# EAGLE schematic PCB(beta) (EAGLE 8.1.0), part 2 of 2
## Sheet 19 of 20: USB 3.0 Hub
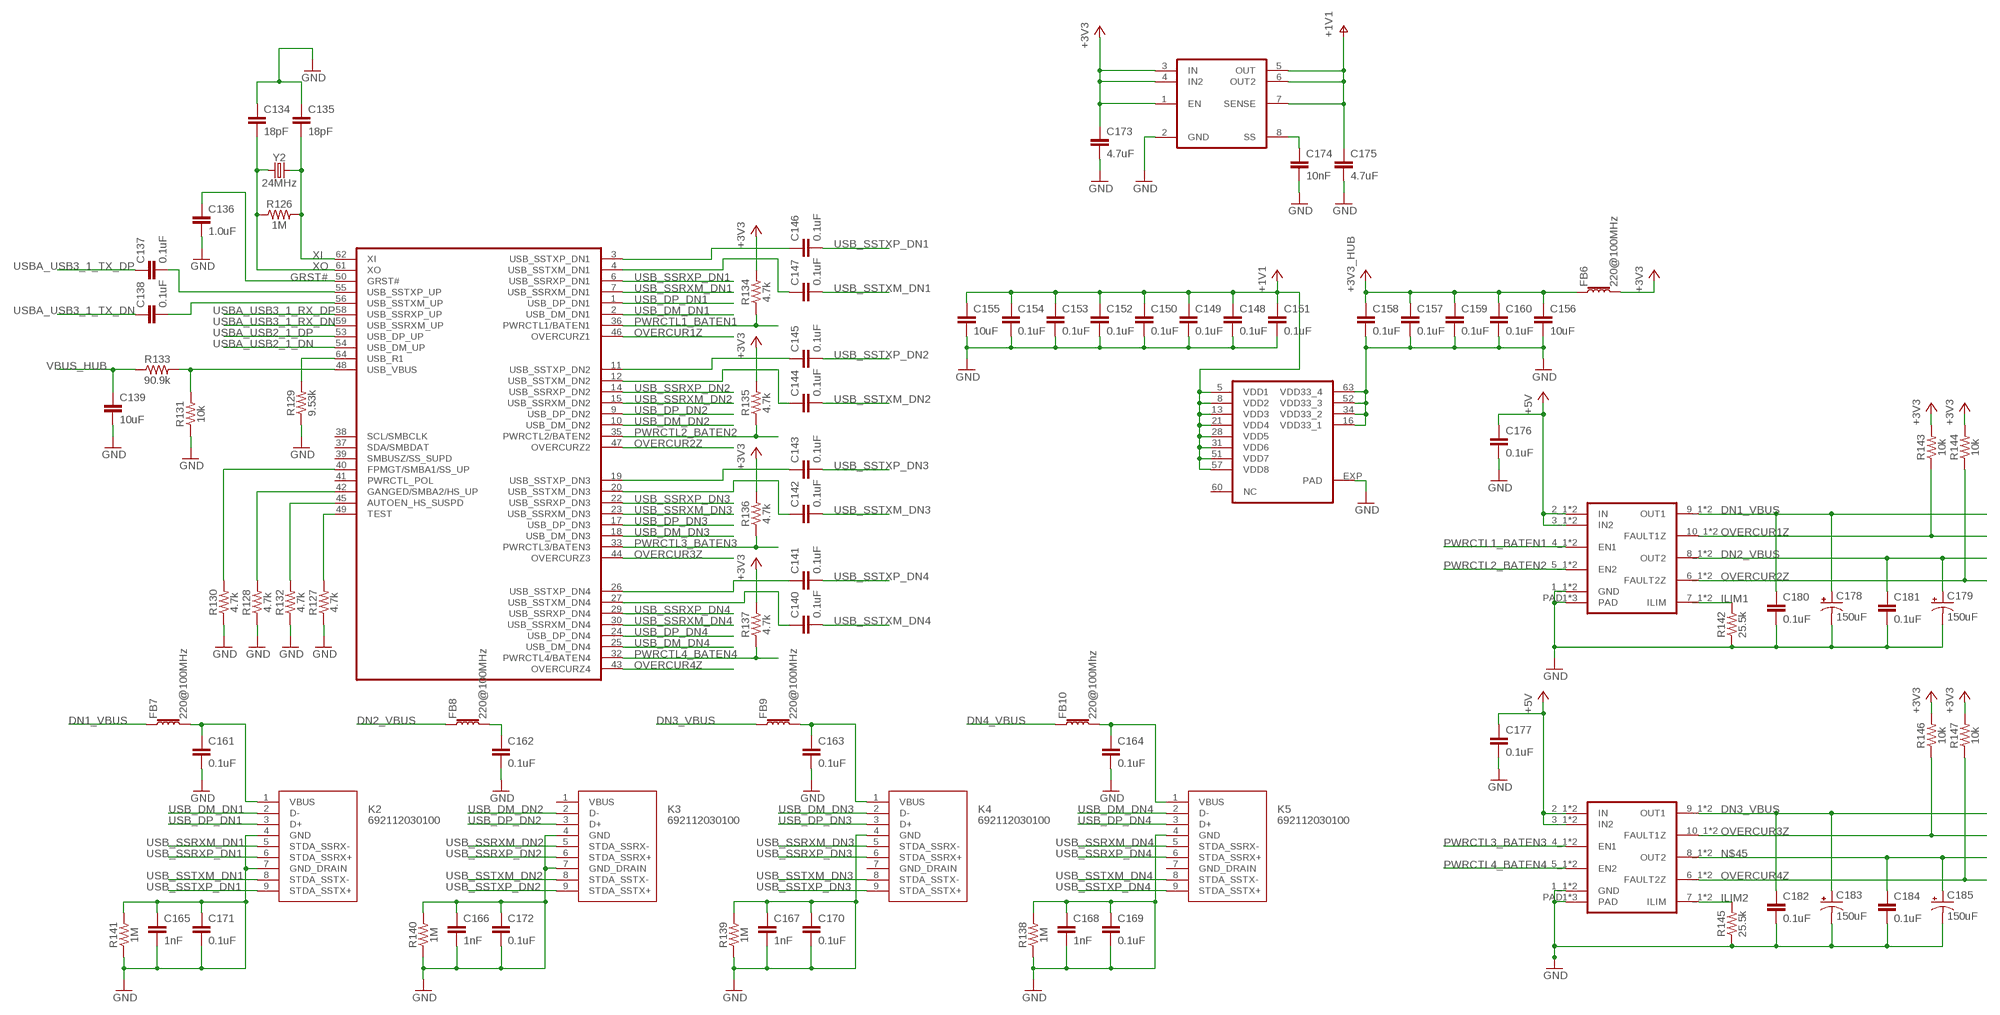
[diagram p18: schematic, sheet 19]

### Parts
C134  18pF  18PF-0603-50V-5%  [0603]
C135  18pF  18PF-0603-50V-5%  [0603]
C136  1.0uF  1.0UF-0603-16V-10%  [0603]
C137  0.1uF  0.1UF-0603-25V-(+80/-20%)  [0603]
C138  0.1uF  0.1UF-0603-25V-(+80/-20%)  [0603]
C139  10uF  10UF-0603-6.3V-20%  [0603]
C140  0.1uF  0.1UF-0603-25V-(+80/-20%)  [0603]
C141  0.1uF  0.1UF-0603-25V-(+80/-20%)  [0603]
C142  0.1uF  0.1UF-0603-25V-(+80/-20%)  [0603]
C143  0.1uF  0.1UF-0603-25V-(+80/-20%)  [0603]
C144  0.1uF  0.1UF-0603-25V-(+80/-20%)  [0603]
C145  0.1uF  0.1UF-0603-25V-(+80/-20%)  [0603]
C146  0.1uF  0.1UF-0603-25V-(+80/-20%)  [0603]
C147  0.1uF  0.1UF-0603-25V-(+80/-20%)  [0603]
C148  0.1uF  0.1UF-0603-25V-(+80/-20%)  [0603]
C149  0.1uF  0.1UF-0603-25V-(+80/-20%)  [0603]
C150  0.1uF  0.1UF-0603-25V-(+80/-20%)  [0603]
C151  0.1uF  0.1UF-0603-25V-(+80/-20%)  [0603]
C152  0.1uF  0.1UF-0603-25V-(+80/-20%)  [0603]
C153  0.1uF  0.1UF-0603-25V-(+80/-20%)  [0603]
C154  0.1uF  0.1UF-0603-25V-(+80/-20%)  [0603]
C155  10uF  10UF-0603-6.3V-20%  [0603]
C156  10uF  10UF-0603-6.3V-20%  [0603]
C157  0.1uF  0.1UF-0603-25V-(+80/-20%)  [0603]
C158  0.1uF  0.1UF-0603-25V-(+80/-20%)  [0603]
C159  0.1uF  0.1UF-0603-25V-(+80/-20%)  [0603]
C160  0.1uF  0.1UF-0603-25V-(+80/-20%)  [0603]
C161  0.1uF  0.1UF-0603-25V-(+80/-20%)  [0603]
C162  0.1uF  0.1UF-0603-25V-(+80/-20%)  [0603]
C163  0.1uF  0.1UF-0603-25V-(+80/-20%)  [0603]
C164  0.1uF  0.1UF-0603-25V-(+80/-20%)  [0603]
C165  1nF  1.0NF/1000PF-0603-50V-10%  [0603]
C166  1nF  1.0NF/1000PF-0603-50V-10%  [0603]
C167  1nF  1.0NF/1000PF-0603-50V-10%  [0603]
C168  1nF  1.0NF/1000PF-0603-50V-10%  [0603]
C169  0.1uF  0.1UF-0603-25V-(+80/-20%)  [0603]
C170  0.1uF  0.1UF-0603-25V-(+80/-20%)  [0603]
C171  0.1uF  0.1UF-0603-25V-(+80/-20%)  [0603]
C172  0.1uF  0.1UF-0603-25V-(+80/-20%)  [0603]
C173  4.7uF  4.7UF0603  [0603]
C174  10nF  10NF-0603-50V-10%  [0603]
C175  4.7uF  4.7UF0603  [0603]
C176  0.1uF  0.1UF-0603-25V-(+80/-20%)  [0603]
C177  0.1uF  0.1UF-0603-25V-(+80/-20%)  [0603]
C178  150uF  100UF-POLAR-RADIAL-2.5MM-25V-20%  [CPOL-RADIAL-2.5MM-6.5MM]
C179  150uF  100UF-POLAR-RADIAL-2.5MM-25V-20%  [CPOL-RADIAL-2.5MM-6.5MM]
C180  0.1uF  0.1UF-0603-25V-(+80/-20%)  [0603]
C181  0.1uF  0.1UF-0603-25V-(+80/-20%)  [0603]
C182  0.1uF  0.1UF-0603-25V-(+80/-20%)  [0603]
C183  150uF  100UF-POLAR-RADIAL-2.5MM-25V-20%  [CPOL-RADIAL-2.5MM-6.5MM]
C184  0.1uF  0.1UF-0603-25V-(+80/-20%)  [0603]
C185  150uF  100UF-POLAR-RADIAL-2.5MM-25V-20%  [CPOL-RADIAL-2.5MM-6.5MM]
FB6  220@100MHz  FERRITE_BEAD-0603  [0603]
FB7  220@100MHz  FERRITE_BEAD-0603  [0603]
FB8  220@100MHz  FERRITE_BEAD-0603  [0603]
FB9  220@100MHz  FERRITE_BEAD-0603  [0603]
FB10  220@100Mhz  FERRITE_BEAD-0603  [0603]
K2  692112030100  [692112030100]
K3  692112030100  [692112030100]
K4  692112030100  [692112030100]
K5  692112030100  [692112030100]
R126  1M  1MOHM-0603-1/4W-5%  [0603]
R127  4.7k  4.7KOHM-0603-1/10W-1%  [0603]
R128  4.7k  4.7KOHM-0603-1/10W-1%  [0603]
R129  9.53k  9.76KOHM-0603-1/10W-1%  [0603]
R130  4.7k  4.7KOHM-0603-1/10W-1%  [0603]
R131  10k  10KOHM-0603-1/10W-1%  [0603]
R132  4.7k  4.7KOHM-0603-1/10W-1%  [0603]
R133  90.9k  100KOHM-0603-1/10W-1%  [0603]
R134  4.7k  4.7KOHM-0603-1/10W-1%  [0603]
R135  4.7k  4.7KOHM-0603-1/10W-1%  [0603]
R136  4.7k  4.7KOHM-0603-1/10W-1%  [0603]
R137  4.7k  4.7KOHM-0603-1/10W-1%  [0603]
R138  1M  1MOHM-0603-1/4W-5%  [0603]
R139  1M  1MOHM-0603-1/4W-5%  [0603]
R140  1M  1MOHM-0603-1/4W-5%  [0603]
R141  1M  1MOHM-0603-1/4W-5%  [0603]
R142  25.5k  26.7KOHM0603-1/10W-1%  [0603]
R143  10k  10KOHM-0603-1/10W-1%  [0603]
R144  10k  10KOHM-0603-1/10W-1%  [0603]
R145  25.5k  26.7KOHM0603-1/10W-1%  [0603]
R146  10k  10KOHM-0603-1/10W-1%  [0603]
R147  10k  10KOHM-0603-1/10W-1%  [0603]
U$57  TUSB8041  [QFN64-9X9]
U$58  ADP1706ARDZ-1.1-R7  [SOIC8]
U$59  TPS2561DRCT  [10-VSON]
U$60  TPS2561DRCT  [10-VSON]
Y2  24MHz  CRYSTAL-24MHZ"  [CRYSTAL-SMD-5X3.2-4PAD]

### Nets
+1V1: C148.1 C149.1 C150.1 C151.1 C152.1 C153.1 C154.1 C155.1 C175.1 U$57.5(VDD1) U$57.8(VDD2) U$57.13(VDD3) U$57.21(VDD4) U$57.28(VDD5) U$57.31(VDD6) U$57.51(VDD7) U$57.57(VDD8) U$58.5(OUT) U$58.6(OUT2) U$58.7(SENSE)
+3V3: C173.1 FB6.2 R134.2 R135.2 R136.2 R137.2 R143.2 R144.2 R146.2 R147.2 U$58.1(EN) U$58.3(IN) U$58.4(IN2) ; also sheet 5,7,9,10,11,13,15,17,18,20
+3V3_HUB: C156.1 C157.1 C158.1 C159.1 C160.1 FB6.1
+5V: C176.1 C177.1 U$59.2_1(IN) U$59.2_2(IN) U$59.3_1(IN2) U$59.3_2(IN2) U$60.2_1(IN) U$60.2_2(IN) U$60.3_1(IN2) U$60.3_2(IN2) ; also sheet 4,9,12,14,15,17,18
DN1_VBUS: C178.1(+) C180.1 FB7.1 U$59.9_1(OUT1) U$59.9_2(OUT1)
DN2_VBUS: C179.1(+) C181.1 FB8.1 U$59.8_1(OUT2) U$59.8_2(OUT2)
DN3_VBUS: C182.1 C183.1(+) FB9.1 U$60.9_1(OUT1) U$60.9_2(OUT1)
DN4_VBUS: FB10.1
GND: C134.1 C135.1 C136.2 C139.2 C148.2 C149.2 C150.2 C151.2 C152.2 C153.2 C154.2 C155.2 C156.2 C157.2 C158.2 C159.2 C160.2 C161.2 C162.2 C163.2 C164.2 C165.1 C165.2 C166.1 C166.2 C167.1 C167.2 C168.1 C168.2 C169.1 C169.2 C170.1 C170.2 C171.1 C171.2 C172.1 C172.2 C173.2 C174.2 C175.2 C176.2 C177.2 C178.2(-) C179.2(-) C180.2 C181.2 C182.2 C183.2(-) C184.2 C185.2(-) K2.4(GND) K2.7(GND_DRAIN) K3.4(GND) K3.7(GND_DRAIN) K4.4(GND) K5.4(GND) R127.1 R128.1 R129.1 R130.1 R131.1 R132.1 R138.1 R138.2 R139.1 R139.2 R140.1 R140.2 R141.1 R141.2 R142.1 R145.1 U$57.16(VDD33_1) U$57.34(VDD33_2) U$57.52(VDD33_3) U$57.63(VDD33_4) U$57.EXP(PAD) U$58.2(GND) U$59.1_1(GND) U$59.1_2(GND) U$59.PAD1(PAD) U$59.PAD2(PAD) U$59.PAD3(PAD) U$60.1_1(GND) U$60.1_2(GND) U$60.PAD1(PAD) U$60.PAD2(PAD) U$60.PAD3(PAD) ; also sheet 1,2,3,4,5,6,7,9,10,11,12,13,14,15,16,17,18,20
GRST#: C136.1 U$57.50(GRST#)
ILIM1: R142.2 U$59.7_1(ILIM) U$59.7_2(ILIM)
ILIM2: R145.2 U$60.7_1(ILIM) U$60.7_2(ILIM)
N$18: R127.2 U$57.49(TEST)
N$20: R129.2 U$57.64(USB_R1)
N$22: R132.2 U$57.45(AUTOEN_HS_SUSPD)
N$23: R128.2 U$57.42(GANGED/SMBA2/HS_UP)
N$24: R130.2 U$57.40(FPMGT/SMBA1/SS_UP)
N$25: R131.2 R133.2 U$57.48(USB_VBUS)
N$26: C140.1 U$57.27(USB_SSTXM_DN4)
N$27: C141.1 U$57.26(USB_SSTXP_DN4)
N$28: C142.1 U$57.20(USB_SSTXM_DN3)
N$29: C143.1 U$57.19(USB_SSTXP_DN3)
N$30: C144.1 U$57.12(USB_SSTXM_DN2)
N$31: C145.1 U$57.11(USB_SSTXP_DN2)
N$32: C147.1 U$57.4(USB_SSTXM_DN1)
N$33: C146.1 U$57.3(USB_SSTXP_DN1)
N$35: C161.1 FB7.2 K2.1(VBUS)
N$36: C174.1 U$58.8(SS)
N$38: C162.1 FB8.2
N$40: C163.1 FB9.2 K4.1(VBUS)
N$45: C184.1 C185.1(+) U$60.8_1(OUT2) U$60.8_2(OUT2)
N$73: C164.1 FB10.2 K5.1(VBUS)
OVERCUR1Z: R143.1 U$57.46(OVERCURZ1) U$59.10_1(FAULT1Z) U$59.10_2(FAULT1Z)
OVERCUR2Z: R144.1 U$57.47(OVERCURZ2) U$59.6_1(FAULT2Z) U$59.6_2(FAULT2Z)
OVERCUR3Z: R146.1 U$57.44(OVERCURZ3) U$60.10_1(FAULT1Z) U$60.10_2(FAULT1Z)
OVERCUR4Z: R147.1 U$57.43(OVERCURZ4) U$60.6_1(FAULT2Z) U$60.6_2(FAULT2Z)
PWRCTL1_BATEN1: R134.1 U$57.36(PWRCTL1/BATEN1) U$59.4_1(EN1) U$59.4_2(EN1)
PWRCTL2_BATEN2: R135.1 U$57.35(PWRCTL2/BATEN2) U$59.5_1(EN2) U$59.5_2(EN2)
PWRCTL3_BATEN3: R136.1 U$57.33(PWRCTL3/BATEN3) U$60.4_1(EN1) U$60.4_2(EN1)
PWRCTL4_BATEN4: R137.1 U$57.32(PWRCTL4/BATEN4) U$60.5_1(EN2) U$60.5_2(EN2)
USB_DM_DN1: K2.2(D-) U$57.2(USB_DM_DN1)
USB_DM_DN2: K3.2(D-) U$57.10(USB_DM_DN2)
USB_DM_DN3: K4.2(D-) U$57.18(USB_DM_DN3)
USB_DM_DN4: K5.2(D-) U$57.25(USB_DM_DN4)
USB_DP_DN1: K2.3(D+) U$57.1(USB_DP_DN1)
USB_DP_DN2: K3.3(D+) U$57.9(USB_DP_DN2)
USB_DP_DN3: K4.3(D+) U$57.17(USB_DP_DN3)
USB_DP_DN4: K5.3(D+) U$57.24(USB_DP_DN4)
USB_SSRXM_DN1: K2.5(STDA_SSRX-) U$57.7(USB_SSRXM_DN1)
USB_SSRXM_DN2: K3.5(STDA_SSRX-) U$57.15(USB_SSRXM_DN2)
USB_SSRXM_DN3: K4.5(STDA_SSRX-) U$57.23(USB_SSRXM_DN3)
USB_SSRXM_DN4: K5.5(STDA_SSRX-) U$57.30(USB_SSRXM_DN4)
USB_SSRXP_DN1: K2.6(STDA_SSRX+) U$57.6(USB_SSRXP_DN1)
USB_SSRXP_DN2: K3.6(STDA_SSRX+) U$57.14(USB_SSRXP_DN2)
USB_SSRXP_DN3: K4.6(STDA_SSRX+) U$57.22(USB_SSRXP_DN3)
USB_SSRXP_DN4: K5.6(STDA_SSRX+) U$57.29(USB_SSRXP_DN4)
USB_SSTXM_DN1: C147.2 K2.8(STDA_SSTX-)
USB_SSTXM_DN2: C144.2 K3.8(STDA_SSTX-)
USB_SSTXM_DN3: C142.2 K4.8(STDA_SSTX-)
USB_SSTXM_DN4: C140.2 K5.8(STDA_SSTX-)
USB_SSTXP_DN1: C146.2 K2.9(STDA_SSTX+)
USB_SSTXP_DN2: C145.2 K3.9(STDA_SSTX+)
USB_SSTXP_DN3: C143.2 K4.9(STDA_SSTX+)
USB_SSTXP_DN4: C141.2 K5.9(STDA_SSTX+)
USBA_USB2_1_DN: U$57.54(USB_DM_UP) ; also sheet 8
USBA_USB2_1_DP: U$57.53(USB_DP_UP) ; also sheet 8
USBA_USB3_1_RX_DN: U$57.59(USB_SSRXM_UP) ; also sheet 8
USBA_USB3_1_RX_DP: U$57.58(USB_SSRXP_UP) ; also sheet 8
USBA_USB3_1_TX_DN: C138.1 ; also sheet 8
USBA_USB3_1_TX_DP: C137.1 ; also sheet 8
VBUS_HUB: C139.1 R133.1
X: C137.2 U$57.55(USB_SSTXP_UP)
XI: C135.2 R126.2 U$57.62(XI) Y2.3
XO: C134.2 R126.1 U$57.61(XO) Y2.1
Y: C138.2 U$57.56(USB_SSTXM_UP)
Unconnected: K3.1(VBUS) K4.7(GND_DRAIN) K5.7(GND_DRAIN) U$57.37(SDA/SMBDAT) U$57.38(SCL/SMBCLK) U$57.39(SMBUSZ/SS_SUPD) U$57.41(PWRCTL_POL) U$57.60(NC)

## Sheet 20 of 20
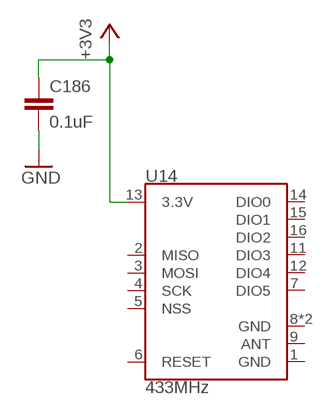
[diagram p19: schematic, sheet 20]

### Parts
C186  0.1uF  0.1UF-0603-25V-(+80/-20%)  [0603]
U14  433MHz  RFM69HCW-433  [RFM69HCW-XXXS2]

### Nets
+3V3: C186.1 U14.13(3.3V) ; also sheet 5,7,9,10,11,13,15,17,18,19
GND: C186.2 ; also sheet 1,2,3,4,5,6,7,9,10,11,12,13,14,15,16,17,18,19
Unconnected: U14.2(MISO) U14.3(MOSI) U14.4(SCK) U14.5(NSS) U14.6(RESET) U14.7(DIO5) U14.9(ANT) U14.11(DIO3) U14.12(DIO4) U14.14(DIO0) U14.15(DIO1) U14.16(DIO2)

## Power pins joined to a net without a drawn wire
GND: U14.1(GND) U14.8(GND) U14.10(GND)

## Library data of the parts
C1-C3 C7 C12 C24-C40 C43-C71 C86-C88 C90 C91 C100-C102 C109-C127 C132 C133 C137 C138 C140-C154 C157-C164 C169-C172 C176 C177 C180-C182 C184 C186 = SparkFun-Capacitors:0.1UF: 0.1µF ceramic capacitors A capacitor is a passive two-terminal electrical component used to store electrical energy temporarily in an electric field.; PROD_ID: CAP-00810
C4 C13-C15 C21 C78-C80 C97 C98 = SparkFun-Capacitors:22UF: 22µF ceramic capacitors A capacitor is a passive two-terminal electrical component used to store electrical energy temporarily in an electric field.; PROD_ID: CAP-08402
C5 C82 = SparkFun-Capacitors:47PF: 47pF ceramic capacitors A capacitor is a passive two-terminal electrical component used to store electrical energy temporarily in an electric field.; PROD_ID: CAP-08913
C6 = SparkFun-Capacitors:100UF-POLAR: 100µF polarized capacitors A capacitor is a passive two-terminal electrical component used to store electrical energy temporarily in an electric field.; PROD_ID: CAP-07890
C8-C10 C17 C23 C72 C76 C89 C92-C94 C99 C105-C108 C128 C129 C139 C155 C156 = SparkFun-Capacitors:10UF: 10.0µF ceramic capacitors A capacitor is a passive two-terminal electrical component used to store electrical energy temporarily in an electric field.; PROD_ID: CAP-11015
C11 C18-C20 C83 C103 C104 C136 = SparkFun-Capacitors:1.0UF: 1µF ceramic capacitors A capacitor is a passive two-terminal electrical component used to store electrical energy temporarily in an electric field.; PROD_ID: CAP-00868
C16 C73 C74 = SparkFun-Capacitors:2.2UF: 2.2µF ceramic capacitors A capacitor is a passive two-terminal electrical component used to store electrical energy temporarily in an electric field.; PROD_ID: CAP-07888
C22 = SparkFun-Capacitors:270PF: 270pF/0.27nF ceramic capacitors A capacitor is a passive two-terminal electrical component used to store electrical energy temporarily in an electric field.; PROD_ID: CAP-13339; VALUE: 270PF
C41 C42 = SparkFun-Capacitors:0.22UF: 0.22µF ceramic capacitors A capacitor is a passive two-terminal electrical component used to store electrical energy temporarily in an electric field.; PROD_ID: CAP-07822
C75 = SparkFun-Capacitors:100UF-POLAR: 100µF polarized capacitors A capacitor is a passive two-terminal electrical component used to store electrical energy temporarily in an electric field.; PROD_ID: CAP-08362
C77 = SparkFun-Capacitors:100PF: 100pF/0.1nF ceramic capacitors A capacitor is a passive two-terminal electrical component used to store electrical energy temporarily in an electric field.; PROD_ID: CAP-07883
C84 C85 = SparkFun-Capacitors:180PF: 180pF/0.18nF ceramic capacitors A capacitor is a passive two-terminal electrical component used to store electrical energy temporarily in an electric field.; PROD_ID: CAP-11661; VALUE: 180pF
C95 = SparkFun-Capacitors:47NF: 47nF ceramic capacitors A capacitor is a passive two-terminal electrical component used to store electrical energy temporarily in an electric field.; PROD_ID: CAP-08605
C96 C173 C175 = SparkFun-Capacitors:4.7UF: 4.7µF ceramic capacitors A capacitor is a passive two-terminal electrical component used to store electrical energy temporarily in an electric field.; PROD_ID: CAP-08280
C130 C131 = SparkFun-Capacitors:22PF: 22pF ceramic capacitors A capacitor is a passive two-terminal electrical component used to store electrical energy temporarily in an electric field.; PROD_ID: CAP-07876
C134 C135 = SparkFun-Capacitors:18PF: 18pF ceramic capacitors A capacitor is a passive two-terminal electrical component used to store electrical energy temporarily in an electric field.; PROD_ID: CAP-08267
C165-C168 = SparkFun-Capacitors:1.0NF/1000PF: 1nF/1,000pF ceramic capacitors A capacitor is a passive two-terminal electrical component used to store electrical energy temporarily in an electric field.; PROD_ID: CAP-07886
C174 = SparkFun-Capacitors:10NF: 0.01uF/10nF/10,000pF ceramic capacitors A capacitor is a passive two-terminal electrical component used to store electrical energy temporarily in an electric field. CAP-09321; PROD_ID: CAP-00867
C178 C179 C183 C185 = SparkFun-Capacitors:100UF-POLAR: 100µF polarized capacitors A capacitor is a passive two-terminal electrical component used to store electrical energy temporarily in an electric field.; PROD_ID: CAP-08439; VALUE: 100uF
CF1 = murata-filter:NFM: EMIFIL(R) (Capacitor type) Single Circuit Type for Signal Lines Source: http://search.murata.co.jp/Ceramy/image/img/PDF/ENG/L0111S0109NFM3DC.pdf; MPN: NFM21CC102R1H3D; OC_FARNELL: 1828795; OC_NEWARK: 84R0165
D1-D3 = SparkFun-DiscreteSemi:DIODE-SCHOTTKY: Schottky diode A Schottky diode is a semiconductor diode which has a low forward voltage drop and a very fast switching action.; PROD_ID: DIO-09886; VALUE: 3A/40V/500mV
D4-D6 = SparkFun-DiscreteSemi:DIODE-SCHOTTKY: Schottky diode A Schottky diode is a semiconductor diode which has a low forward voltage drop and a very fast switching action.; PROD_ID: DIO-10955
D7-D10 = SparkFun-LED:LED-GREEN: Green SMD LED Used in manufacturing of various products at SparkFun Packages: 0603 - SMD 0603 package [Product Link] <http://www.futureelectronics.com/en/technologies/semiconductors/optoelectronics/leds/Pages/9894312-LTST-C190GKT.aspx?CrossPart=HSMG-C190&IM=0> LilyPad 1206 - SMD1206 LilyPad package [Product Link] <http://www.futureelectronics.com/en/Technologies/Product.aspx?ProductID=IN150NGHARVATEKCORPORATION2049943&IM=0> 1206 - SMD1206 package [Product Link] <http://www.futureelectronics.com/en/technologies/semiconductors/optoelectronics/leds/Pages/8315665-LTST-C150KGKT.aspx?IM=0> 1206 Bottom Mount -SMD 1206 Bottom Mount [Product Link] <http://www.digikey.com/product-detail/en/lite-on-inc/LTST-C230KGKT/160-1456-1-ND/386854> SparkFun Products: Pro Mini 328 -5V <https://www.sparkfun.com/products/821> RedBoard <https://www.sparkfun.com/products/12757> MP3 Trigger <https://www.sparkfun.com/products/13720> Makey Makey <https://www.sparkfun.com/products/11076>; PROD_ID: DIO-00821
D11 = SparkFun-LED:LED: LED (Generic) Standard schematic elements and footprints for 5mm, 3mm, 1206, and 0603 sized LEDs. Generic LEDs with no color specified.
F1 F2 = DigiKey:043503.5KRHF; MANUFACTURER_PART_NUMBER: 043503.5KRHF; VENDOR: Littelfuse Inc
FB1-FB10 = SparkFun-Coils:FERRITE_BEAD: Ferrite Bead (blocks, cores, rings, chokes, etc.) Inductor with layers of ferrite used to suppress high frequencies. Often used to isolate high frequency noise. SparkFun Products: IOIO-OTG - V2.2 <https://www.sparkfun.com/products/13613> SparkFun SAMD21 Mini Breakout <https://www.sparkfun.com/products/13664> SparkFun 6 Degrees of Freedom Breakout - LSM6DS3 <https://www.sparkfun.com/products/13339> SparkFun SAMD21 Dev Breakout <https://www.sparkfun.com/products/13672>; PROD_ID: NDUC-07859; VALUE: 30Ω/1.8A
H1-H4 = holes:MOUNT-PAD-ROUND: MOUNTING PAD, round
IC1 = ftdichip-3:FT232RQ: USB UART 4th Generation USB UART (USB <-> Serial) Controller
J1 = SparkFun-Connectors:POWER_JACK: Power Jack Connector This is the standard 5.5mm barrel jack for power. The PTH is the most common, proven, reliable, footprint. The Slot footprint only works if the mill layer is transmitted to the PCB fab house so be warned. Here are the connectors we sell at SparkFun: DC Barrel Power Jack/Connector <https://www.sparkfun.com/products/119> (PRT-00119) DC Barrel Power Jack/Connector (SMD) <https://www.sparkfun.com/products/12748> (PRT-12748) DC Barrel Jack Adapter - Breadboard Compatible <https://www.sparkfun.com/products/10811> (PRT-10811) It is used on this SparkFun product (and many, many others): SparkFun RedBoard - Programmed with Arduino <https://www.sparkfun.com/products/12757> (DEV-12757) Also, if you need a mating power supply or connector, please check these out: Wall Adapter Power Supply - 9VDC 650mA <https://www.sparkfun.com/products/298> (TOL-00298) DC Barrel Jack Adapter - Male <https://www.sparkfun.com/products/10287> (PRT-10287); PROD_ID: CONN-08106; SF_ID: PRT-12748
J2 J8 = SparkFun-Connectors:CONN_03: Multi connection point. Often used as Generic Header-pin footprint for 0.1 inch spaced/style header connections On any of the 0.1 inch spaced packages, you can populate with these: Break Away Headers - Straight <https://www.sparkfun.com/products/116> (PRT-00116) Break Away Male Headers - Right Angle <https://www.sparkfun.com/products/553> (PRT-00553) Female Headers <https://www.sparkfun.com/products/115> (PRT-00115) Break Away Headers - Machine Pin <https://www.sparkfun.com/products/117> (PRT-00117) Break Away Female Headers - Swiss Machine Pin <https://www.sparkfun.com/products/743> (PRT-00743) Stackable Header - 3 Pin (Female, 0.1") <https://www.sparkfun.com/products/13875> (PRT-13875) For SCREWTERMINALS and SPRING TERMINALS visit here: Screw Terimnals on SparkFun.com <https://www.sparkfun.com/search/results?term=Screw+Terminals> (5mm/3.5mm/2.54mm spacing) This device is also useful as a general connection point to wire up your design to another part of your project. Our various solder wires solder well into these plated through hole pads. Hook-Up Wire - Assortment (Stranded, 22 AWG) <https://www.sparkfun.com/products/11375> (PRT-11375) Hook-Up Wire - Assortment (Solid Core, 22 AWG) <https://www.sparkfun.com/products/11367> (PRT-11367) View the entire wire category on our website here <https://www.sparkfun.com/categories/141> Special notes: Molex polarized connector foot print use with SKU : PRT-08232 with associated crimp pins and housings.
J3 = SparkFun-Connectors:USB_MICRO-B: USB Type Micro-B Connector Male/female and PTH/SMT variants SparkFun Products: SparkFun microB USB Breakout <https://www.sparkfun.com/products/12035> SparkFun USB microB Plug Breakout <https://www.sparkfun.com/products/10031> SparkFun ESP8266 Thing <https://www.sparkfun.com/products/13231>; PROD_ID: CONN-11752
J4 = SparkFun-Connectors:CONN_03X2: Multi connection point. Often used as Generic Header-pin footprint for 0.1 inch spaced/style header connections You can populate with any combo of single row headers, but if you'd like an exact match, check these: Header - 2x3 (Male, 0.1") <https://www.sparkfun.com/products/12807> (PRT-12807) Header - 2x3 (Female, 0.1") <https://www.sparkfun.com/products/13010> (PRT-13010) 2x3 Pin Shrouded Header <https://www.sparkfun.com/products/10877> (PRT-10877) On any of the 0.1 inch spaced packages, you can populate with these: Break Away Headers - Straight <https://www.sparkfun.com/products/116> (PRT-00116) Break Away Male Headers - Right Angle <https://www.sparkfun.com/products/553> (PRT-00553) Female Headers <https://www.sparkfun.com/products/115> (PRT-00115) Break Away Headers - Machine Pin <https://www.sparkfun.com/products/117> (PRT-00117) Break Away Female Headers - Swiss Machine Pin <https://www.sparkfun.com/products/743> (PRT-00743) Special note: the shrouded connector mates well with our 3x2 ribbon cables: Ribbon Crimp Connector - 6-pin (2x3, Female) <https://www.sparkfun.com/products/10651> (PRT-10651) Ribbon Cable - 6 wire (15ft) <https://www.sparkfun.com/products/10646> (PRT-10646); PROD_ID: CONN-11566
J5 = Wurth_Elektronik_Electromechanic_Input-Output_Connectors_rev16b:685119134923: WR-COM SMT Horizontal HDMI, 19 pins=>Code : Con_I-O_COM_HDMI_685119134923 <http://katalog.we-online.de/media/images/eican/Con_I-O_COM_HDMI_685119134923_pf2.jpg> Details see: http://katalog.we-online.de/en/em/685_119_134_923 Created 2014-07-09, Karrer Zheng 2014 (C) Würth Elektronik
J6 J7 = Joule Expansion Board:SSM-120-S-DV; MANUFACTURER_PART_NUMBER: SSM120SDV; VENDOR: Samtec Inc
J9 = connector:DM3AT-SF-PEJM5: CONN MICRO SD R/A PUSH-PUSH SMD; DIGIKEY: HR1964CT-ND
J10 = SparkFun-Connectors:CONN_03X2: Multi connection point. Often used as Generic Header-pin footprint for 0.1 inch spaced/style header connections You can populate with any combo of single row headers, but if you'd like an exact match, check these: Header - 2x3 (Male, 0.1") <https://www.sparkfun.com/products/12807> (PRT-12807) Header - 2x3 (Female, 0.1") <https://www.sparkfun.com/products/13010> (PRT-13010) 2x3 Pin Shrouded Header <https://www.sparkfun.com/products/10877> (PRT-10877) On any of the 0.1 inch spaced packages, you can populate with these: Break Away Headers - Straight <https://www.sparkfun.com/products/116> (PRT-00116) Break Away Male Headers - Right Angle <https://www.sparkfun.com/products/553> (PRT-00553) Female Headers <https://www.sparkfun.com/products/115> (PRT-00115) Break Away Headers - Machine Pin <https://www.sparkfun.com/products/117> (PRT-00117) Break Away Female Headers - Swiss Machine Pin <https://www.sparkfun.com/products/743> (PRT-00743) Special note: the shrouded connector mates well with our 3x2 ribbon cables: Ribbon Crimp Connector - 6-pin (2x3, Female) <https://www.sparkfun.com/products/10651> (PRT-10651) Ribbon Cable - 6 wire (15ft) <https://www.sparkfun.com/products/10646> (PRT-10646); PROD_ID: CONN-11290
K2-K5 = Joule Expansion Board:692112030100: WR-COM USB 3.0 SMT PLUG WITH CLIPTYPE A
P1 = 1-2295018-2:1-2295018-2: Conn USB Type C RCP 12 POS Solder RA SMD 12 Terminal 1 Port T/R; AVAILABILITY: Good; DESCRIPTION: Conn USB Type C RCP 12 POS Solder RA SMD 12 Terminal 1 Port T/R; MF: TE Connectivity / AMP; MP: 1-2295018-2; PACKAGE: None; PRICE: 1.83 USD
PAD1-PAD4 = wirepad:2,54/1,0: THROUGH-HOLE PAD
Q1 Q2 = SparkFun-DiscreteSemi:TRANS_NPN_DUAL: Dual NPN Transistors in Single Package The MBT3904W1 puts two general purpose 3904 NPN transistors in a single package. Datasheet <http://www.onsemi.com/pub_link/Collateral/MBT3904DW1T1-D.PDF> SparkFun Products: SparkFun ESP32 Thing <https://www.sparkfun.com/products/13907>; PROD_ID: TRANS-13337
Q3 Q4 = SparkFun-DiscreteSemi:MOSFET-NCH: N-channel MOSFETs Voltage controlled devices that allow control of high current outputs. SparkFun Products: SparkFun OpenScale <https://www.sparkfun.com/products/13261> SparkFun Digital Sandbox <https://www.sparkfun.com/products/12651> SparkFun Monster Moto Shield <https://www.sparkfun.com/products/10182> SparkFun MOSFET Power Controller <https://www.sparkfun.com/products/11214>; PROD_ID: TRANS-00830
R1 R4 R5 R10 R18 R19 R21 R68-R76 R80 R85-R89 R91 R98 R108 = SparkFun-Resistors:0OHM: 0Ω resistor A resistor is a passive two-terminal electrical component that implements electrical resistance as a circuit element. Resistors act to reduce current flow, and, at the same time, act to lower voltage levels within circuits. - Wikipedia; PROD_ID: RES-08609
R2 = SparkFun-Resistors:1.8KOHM: 1.8kΩ resistor A resistor is a passive two-terminal electrical component that implements electrical resistance as a circuit element. Resistors act to reduce current flow, and, at the same time, act to lower voltage levels within circuits. - Wikipedia; PROD_ID: RES-09119; VALUE: 1.8k
R3 R12-R15 R17 R64-R67 R77 R93 R96 R100 R109-R115 R119-R125 R131 R143 R144 R146 R147 = SparkFun-Resistors:10KOHM: 10kΩ resistor A resistor is a passive two-terminal electrical component that implements electrical resistance as a circuit element. Resistors act to reduce current flow, and, at the same time, act to lower voltage levels within circuits. - Wikipedia; PROD_ID: RES-00824
R6 R7 R11 R20 R25-R28 R31-R38 R48-R53 R58-R60 R81 R82 R90 R94 R97 R101-R104 R106 = SparkFun-Resistors:100KOHM: 100kΩ resistor A resistor is a passive two-terminal electrical component that implements electrical resistance as a circuit element. Resistors act to reduce current flow, and, at the same time, act to lower voltage levels within circuits. - Wikipedia; PROD_ID: RES-07828
R8 = SparkFun-Resistors:2.2OHM: 2.2Ω resistor A resistor is a passive two-terminal electrical component that implements electrical resistance as a circuit element. Resistors act to reduce current flow, and, at the same time, act to lower voltage levels within circuits. - Wikipedia; PROD_ID: RES-07823; VALUE: 2.2
R9 R107 R133 = SparkFun-Resistors:100KOHM: 100kΩ resistor A resistor is a passive two-terminal electrical component that implements electrical resistance as a circuit element. Resistors act to reduce current flow, and, at the same time, act to lower voltage levels within circuits. - Wikipedia; PROD_ID: RES-07828; VALUE: 100k
R16 R24 R29 R30 R39 R54-R57 R83 = SparkFun-Resistors:200KOHM: 200kΩ resistor A resistor is a passive two-terminal electrical component that implements electrical resistance as a circuit element. Resistors act to reduce current flow, and, at the same time, act to lower voltage levels within circuits. - Wikipedia; PROD_ID: RES-09385
R22 R23 R117 R118 = SparkFun-Resistors:2.55KOHM: 2.55kΩ resistor A resistor is a passive two-terminal electrical component that implements electrical resistance as a circuit element. Resistors act to reduce current flow, and, at the same time, act to lower voltage levels within circuits. - Wikipedia; PROD_ID: RES-11227; VALUE: 2.55k
R40-R43 = SparkFun-Resistors:1.5KOHM: 1.5kΩ resistor A resistor is a passive two-terminal electrical component that implements electrical resistance as a circuit element. Resistors act to reduce current flow, and, at the same time, act to lower voltage levels within circuits. - Wikipedia; PROD_ID: RES-08306; VALUE: 1.5k
R44-R47 = SparkFun-Resistors:510OHM: 510Ω resistor A resistor is a passive two-terminal electrical component that implements electrical resistance as a circuit element. Resistors act to reduce current flow, and, at the same time, act to lower voltage levels within circuits. - Wikipedia; PROD_ID: RES-08717; VALUE: 510
R61 R105 = SparkFun-Resistors:100OHM: 100Ω resistor A resistor is a passive two-terminal electrical component that implements electrical resistance as a circuit element. Resistors act to reduce current flow, and, at the same time, act to lower voltage levels within circuits. - Wikipedia; PROD_ID: RES-12438
R62 R63 = SparkFun-Resistors:3.3KOHM: 3.3kΩ resistor A resistor is a passive two-terminal electrical component that implements electrical resistance as a circuit element. Resistors act to reduce current flow, and, at the same time, act to lower voltage levels within circuits. - Wikipedia; PROD_ID: RES-07851
R78 R84 = SparkFun-Resistors:1KOHM: 1kΩ resistor A resistor is a passive two-terminal electrical component that implements electrical resistance as a circuit element. Resistors act to reduce current flow, and, at the same time, act to lower voltage levels within circuits. - Wikipedia; PROD_ID: RES-07856
R79 = SparkFun-Resistors:1.5KOHM: 1.5kΩ resistor A resistor is a passive two-terminal electrical component that implements electrical resistance as a circuit element. Resistors act to reduce current flow, and, at the same time, act to lower voltage levels within circuits. - Wikipedia; PROD_ID: RES-08306
R92 R95 = SparkFun-Resistors:1KOHM: 1kΩ resistor A resistor is a passive two-terminal electrical component that implements electrical resistance as a circuit element. Resistors act to reduce current flow, and, at the same time, act to lower voltage levels within circuits. - Wikipedia; PROD_ID: RES-07856; VALUE: 1k
R99 = SparkFun-Resistors:510OHM: 510Ω resistor A resistor is a passive two-terminal electrical component that implements electrical resistance as a circuit element. Resistors act to reduce current flow, and, at the same time, act to lower voltage levels within circuits. - Wikipedia; PROD_ID: RES-08717
R116 = SparkFun-Resistors:4.7KOHM: 4.7kΩ resistor A resistor is a passive two-terminal electrical component that implements electrical resistance as a circuit element. Resistors act to reduce current flow, and, at the same time, act to lower voltage levels within circuits. - Wikipedia; PROD_ID: RES-07857; VALUE: 4.7k
R126 R138-R141 = SparkFun-Resistors:1MOHM: 1MΩ resistor A resistor is a passive two-terminal electrical component that implements electrical resistance as a circuit element. Resistors act to reduce current flow, and, at the same time, act to lower voltage levels within circuits. - Wikipedia; PROD_ID: RES-07868
R127 R128 R130 R132 R134-R137 = SparkFun-Resistors:4.7KOHM: 4.7kΩ resistor A resistor is a passive two-terminal electrical component that implements electrical resistance as a circuit element. Resistors act to reduce current flow, and, at the same time, act to lower voltage levels within circuits. - Wikipedia; PROD_ID: RES-07857
R129 = SparkFun-Resistors:9.76KOHM: 9.76kΩ resistor A resistor is a passive two-terminal electrical component that implements electrical resistance as a circuit element. Resistors act to reduce current flow, and, at the same time, act to lower voltage levels within circuits. - Wikipedia; PROD_ID: RES-12534; VALUE: 9.76k
R142 R145 = SparkFun-Resistors:26.7KOHM: 26.7kΩ resistor A resistor is a passive two-terminal electrical component that implements electrical resistance as a circuit element. Resistors act to reduce current flow, and, at the same time, act to lower voltage levels within circuits. - Wikipedia; PROD_ID: RES-12186; VALUE: 26.7k
S1-S4 = SparkFun-Switches:MOMENTARY-SWITCH-SPST-2: Momentary Switch (Pushbutton) - SPST - Two Circuits Normally-open (NO) SPST momentary switches (buttons, pushbuttons). Schematic symbol includes two switch circuits. Variants SMD-4.6MMX2.8MM - 4.60mm x 2.80mm Tactile Momentary Button Switch - Used on SparkFun SAMD21 Mini Breakout <https://www.sparkfun.com/products/13664> SMD-5.2MM - Mini Pushbutton Switch - SMD <https://www.sparkfun.com/products/8720> - Used on Arduino Pro Mini <https://www.sparkfun.com/products/11114>; PROD_ID: SWCH-13065
U1 = Texas Instruments_By_element14_Batch_1:TPS2553DBVT: PRECISION ADJUSTABLE CURRENT-LIMITED POWER-DISTRIBUTION SWITCHES; MPN: TPS2553DBVT; OC_FARNELL: 1694425; OC_NEWARK: 40P3870; PACKAGE: SOT-23-6; SUPPLIER: Texas Instruments
U2 = Joule Expansion Board:TLV62084DSGR; MANUFACTURER_PART_NUMBER: tlv62084dsgr; VENDOR: Texas Instruments
U3-U12 = Joule Expansion Board:LSF0108RKSR; MANUFACTURER_PART_NUMBER: lsf0108rksr; VENDOR: Texas Instruments
U13 = SparkFun-IC-Microcontroller:ATMEGA328P_TQFP: Popular 328P in QFP Storefront component: ATmega328 - TQFP <https://www.sparkfun.com/products/13448> (COM-13448) Datasheet <http://www.sparkfun.com/datasheets/Components/SMD/ATMega328.pdf> SparkFun Products SparkFun RedBoard - Programmed with Arduino <https://www.sparkfun.com/products/12757> (DEV-12757) Arduino Pro Mini 328 - 5V/16MHz <https://www.sparkfun.com/products/11113> (DEV-11113) Arduino Pro Mini 328 - 3.3V/8MHz <https://www.sparkfun.com/products/11114> (DEV-11114) SparkFun OpenLog <https://www.sparkfun.com/products/13712> (DEV-13712) SparkFun MicroView - OLED Arduino Module <https://www.sparkfun.com/products/12923> (DEV-12923) SparkFun Digital Sandbox <https://www.sparkfun.com/products/12651> (DEV-12651) SparkFun PicoBoard <https://www.sparkfun.com/products/11888> (WIG-11888) Arduino Fio <https://www.sparkfun.com/products/10116> (DEV-10116) LilyPad Arduino 328 Main Board <https://www.sparkfun.com/products/13342> (DEV-13342) SparkFun RedStick <https://www.sparkfun.com/products/13741> (DEV-13741) LilyPad MP3 <https://www.sparkfun.com/products/11013> (DEV-11013) LilyPad Arduino SimpleSnap <https://www.sparkfun.com/products/10941> (DEV-10941) SparkFun Stepoko <https://www.sparkfun.com/products/13899> (ROB-13899) SparkFun Geiger Counter <https://www.sparkfun.com/products/11345> (SEN-11345) SparkFun EL Sequencer <https://www.sparkfun.com/products/12781> (COM-12781) Arduino Pro 328 - 5V/16MHz <https://www.sparkfun.com/products/10915> (DEV-10915) CryptoCape <https://www.sparkfun.com/products/12773> (DEV-12773) SparkFun IR Thermometer Evaluation Board - MLX90614 <https://www.sparkfun.com/products/10740> (SEN-10740) SparkFun RedBot Mainboard <https://www.sparkfun.com/products/12097> (ROB-12097) Arduino Pro 328 - 3.3V/8MHz <https://www.sparkfun.com/products/10914> (DEV-10914) SparkFun Block for Intel® Edison - Arduino <https://www.sparkfun.com/products/13036> (DEV-13036) SparkFun Simon Says - Surface Mount Soldering Kit <https://www.sparkfun.com/products/10935> (KIT-10935) SparkFun 7-Segment Serial Display - Red <https://www.sparkfun.com/products/11441> (COM-11441) SparkFun 7-Segment Serial Display - White <https://www.sparkfun.com/products/11629> (COM-11629) SparkFun 7-Segment Serial Display - Yellow <https://www.sparkfun.com/products/11443> (COM-11443) SparkFun 7-Segment Serial Display - Kelly Green <https://www.sparkfun.com/products/11440> (COM-11440) SparkFun 7-Segment Serial Display - Blue <https://www.sparkfun.com/products/11442> (COM-11442) SparkFun OpenSegment Serial Display - 20mm (Blue) <https://www.sparkfun.com/products/11647> (COM-11647) SparkFun OpenSegment Serial Display - 20mm (Green) <https://www.sparkfun.com/products/11646> (COM-11646) SparkFun OpenSegment Serial Display - 20mm (White) <https://www.sparkfun.com/products/11648> (COM-11648) SparkFun OpenSegment Serial Display - 20mm (Red) <https://www.sparkfun.com/products/11644> (COM-11644) SparkFun OpenSegment Serial Display - 20mm (Yellow) <https://www.sparkfun.com/products/11645> (COM-11645) SparkFun OpenSegment Shield <https://www.sparkfun.com/products/13190> (DEV-13190); PROD_ID: IC-09069
U14 = SparkFun-RF:RFM69H: Hope RF RFM69H ISM Transceiver Module The RFM69H is a transceiver module capable of operation over a wide frequency range, including the 315,433,868 and 915MHz license-free ISM (Industry Scientific and Medical) frequency bands. All major RF communication parameters are programmable and most of them can be dynamically set. The RFM69H offers the unique advantage of programmable narrow-band and wide- band communication modes. The RFM69H is optimized for low power consumption while offering high RF output power and channelized operation.Compliance ETSI and FCC regulations. Datasheet <http://www.hoperf.cn/upload/docs/RF/SX/RFM69H_DataSheet_v1.3.pdf> SparkFun Products RFM69HCW Wireless Transceiver - 915MHz <https://www.sparkfun.com/products/13909> (COM-13909) RFM69HCW Wireless Transceiver - 434MHz <https://www.sparkfun.com/products/13910> (COM-13910) SparkFun RFM69 Breakout (915MHz) <https://www.sparkfun.com/products/12775> (WRL-12775) SparkFun RFM69 Breakout (434MHz) <https://www.sparkfun.com/products/12823> (WRL-12823); PROD_ID: IC-12053
U$1 = DigiKey:TPS63021DSJR; MANUFACTURER_PART_NUMBER: TPS63021DSJR; VENDOR: Texas Instruments
U$2 U$3 U$5 = Joule Expansion Board:LFTVS18-1F3_FLIPCHIP
U$4 = Joule Expansion Board:PI3USB302-AZBEX_ANALOG_SWITCH
U$6-U$11 = Joule Expansion Board:TCE0806S-350-2P-T200
U$12-U$15 = Joule Expansion Board:TCE0806G-900-2P-T200
U$16 = Joule Expansion Board:TSM-102-01-L-DV-TR
U$17 = Joule Expansion Board:M24M02-DRMN6TP
U$18 = Joule Expansion Board:FPF3042UCX
U$19 U$20 = Joule Expansion Board:FPF2495UCX
U$21 = Joule Expansion Board:FAN48623UC50X_SWITCHING_REGULATOR
U$22 U$23 U$53 = Joule Expansion Board:SPM4012T-1R0M
U$24-U$26 = Joule Expansion Board:ECMF02-2BF3
U$27 = Joule Expansion Board:IP4856CX25
U$28 U$52 = Joule Expansion Board:SSM3K56CTL3FCT-ND_NCHAN_MOSFET
U$29 U$31-U$44 U$50 = Joule Expansion Board:LXES15AAA1-100_ESD_SUPPRESSOR
U$30 = Joule Expansion Board:BK-916-TR_12MM_COINCELL
U$45-U$48 = Joule Expansion Board:92320A282_1/8_SPACER
U$49 = Joule Expansion Board:ASPIAIG-S8050
U$51 = Joule Expansion Board:BQ25892RTWT
U$54 = temp:PS8203TQFN32GTR-A3
U$55 U$56 = Joule Expansion Board:DF40C-100DS-0.4V(51)_100PINCONNECTOR
U$57 = Joule Expansion Board:TUSB8041
U$58 = Joule Expansion Board:ADP1706ARDZ-1.1-R7
U$59 U$60 = Joule Expansion Board:TPS2561DRCT
Y1 = SparkFun-Clocks:CRYSTAL-16MHZ: 16MHz Crystal Digikey Example <http://www.digikey.com/product-search/en?keywords=535-9122-1-ND> Frequency: 16MHz Frequency Stability: ±50ppm Frequency Tolerance: ±20ppm Load Capacitance: 18pF SparkFun Products: Pro Micro -5V/16MHz <https://www.sparkfun.com/products/12640> SparkFun Serial Enabled LCD Kit <https://www.sparkfun.com/products/10097>; PROD_ID: XTAL-08218; SF_ID: COM-00094
Y2 = SparkFun-Clocks:CRYSTAL-24MHZ: 24MHz Crystal Datasheet <http://www.sparkfun.com/datasheets/Components/AT-SMD-5x3.pdf> Frequency: 24MHz Frequency Tolerance: ±20ppm Load Capacitance: 12pF SparkFun Products: USB Bit Whacker <https://www.sparkfun.com/products/762>; PROD_ID: XTAL-08298; SF_ID: COM-08581